# EAGLE design Chua (EAGLE 6.6.0)
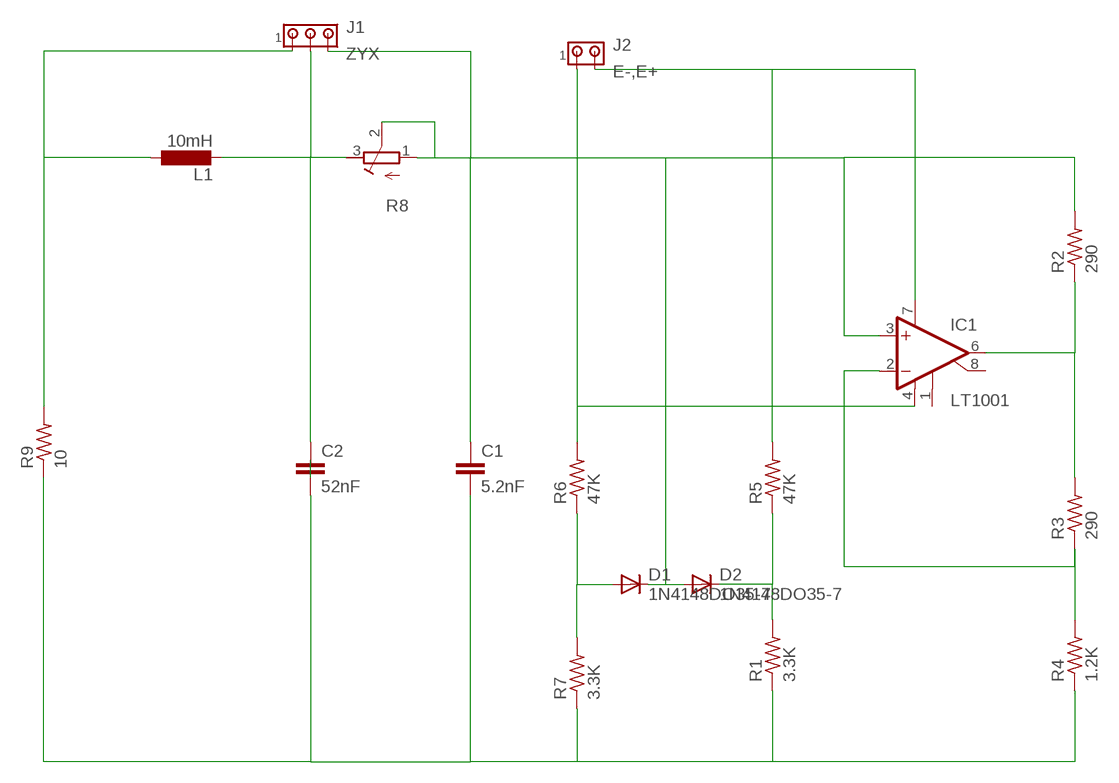
[diagram p0: schematic, sheet 1]

## Parts
C1  5.2nF  C-EU025-060X050  [C025-060X050]
C2  52nF  C-EU025-060X050  [C025-060X050]
D1  1N4148DO35-7  [DO35-7]
D2  1N4148DO35-7  [DO35-7]
IC1  LT1001  LT1001N  [DIL08]
J1  ZYX  MTA03-100  [10X03MTA]
J2  E-,E+  MTA02-100  [10X02MTA]
L1  10mH  L-EU0207/5V  [0207/5V]
R1  3.3K  R-US_0204/7  [0204/7]
R2  290  R-US_0204/7  [0204/7]
R3  290  R-US_0204/7  [0204/7]
R4  1.2K  R-US_0204/7  [0204/7]
R5  47K  R-US_0204/7  [0204/7]
R6  47K  R-US_0204/7  [0204/7]
R7  3.3K  R-US_0204/7  [0204/7]
R8  R-TRIMM3296Y  [RTRIM3296Y]
R9  10  R-US_0204/7  [0204/7]

## Nets
N$1: IC1.6(OUT) R2.1 R3.2
N$2: C1.2 C2.2 R1.1 R4.1 R7.1 R9.1
N$3: IC1.2(-IN) R3.1 R4.2
N$4: D2.C R1.2 R5.1
N$5: D1.A R6.1 R7.2
N$6: C1.1 D1.C D2.A IC1.3(+IN) J1.3 R2.2 R8.1(E) R8.2(S)
N$7: C2.1 J1.2 L1.2 R8.3(A)
N$8: J1.1 L1.1 R9.2
N$11: IC1.4(V-) J2.1 R6.2
N$12: IC1.7(V+) J2.2 R5.2
Unconnected: IC1.1(CMP1) IC1.8(CMP2)

## Library data of the parts
C1 C2 = resistor:C-EU: CAPACITOR, European symbol
D1 D2 = diode:1N4148: DIODE high speed (Philips)
IC1 = linear:LT1001: OP AMP
J1 = con-amp:MTA03-100: AMP connector
J2 = con-amp:MTA02-100: AMP connector
L1 = resistor:L-EU: INDUCTOR, European symbol
R1-R7 R9 = resistor:R-US_: RESISTOR, American symbol
R8 = resistor:R-TRIMM: Trimm resistor

## Board
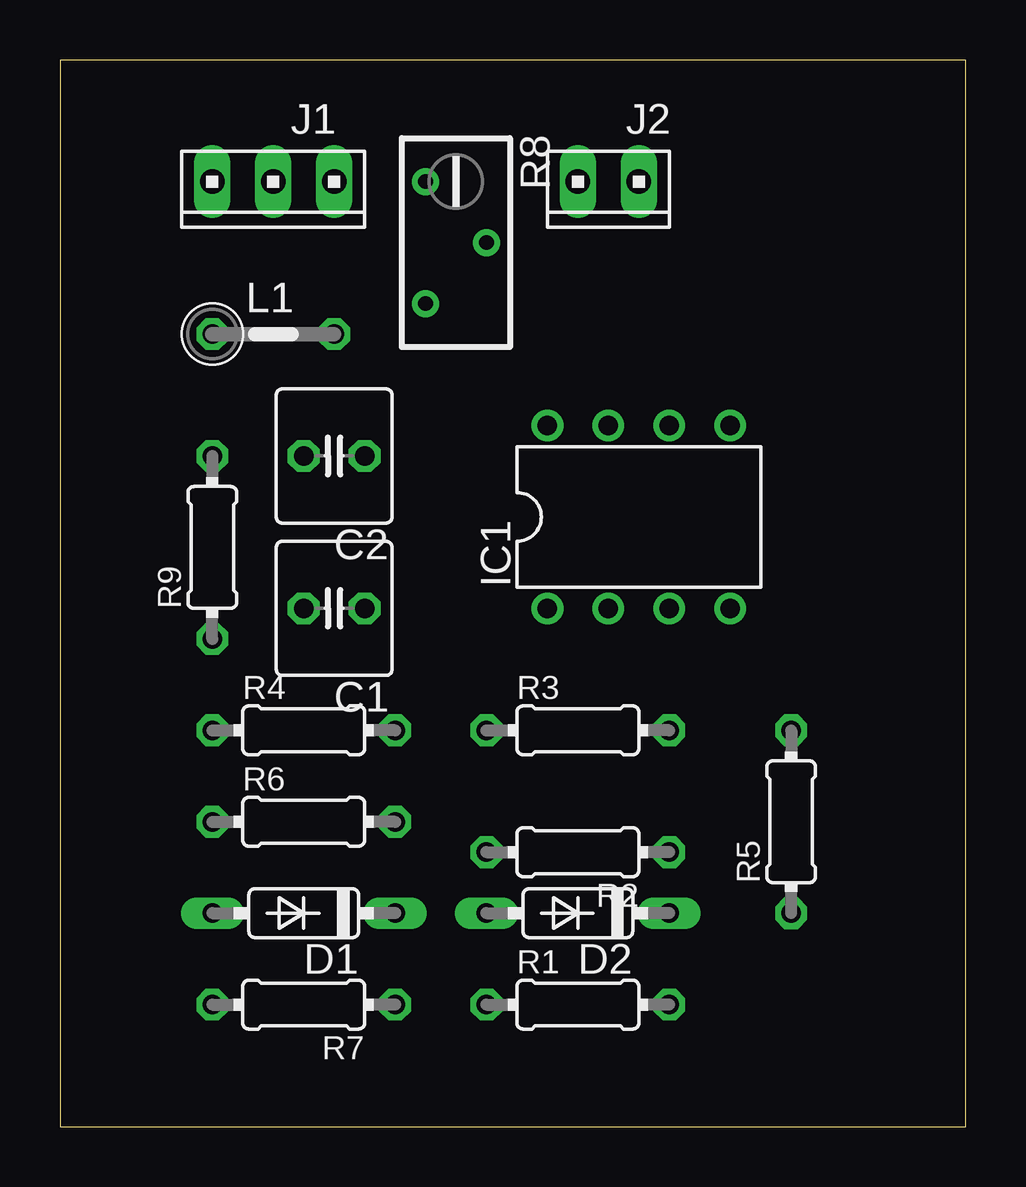
[diagram p1: board, top side]
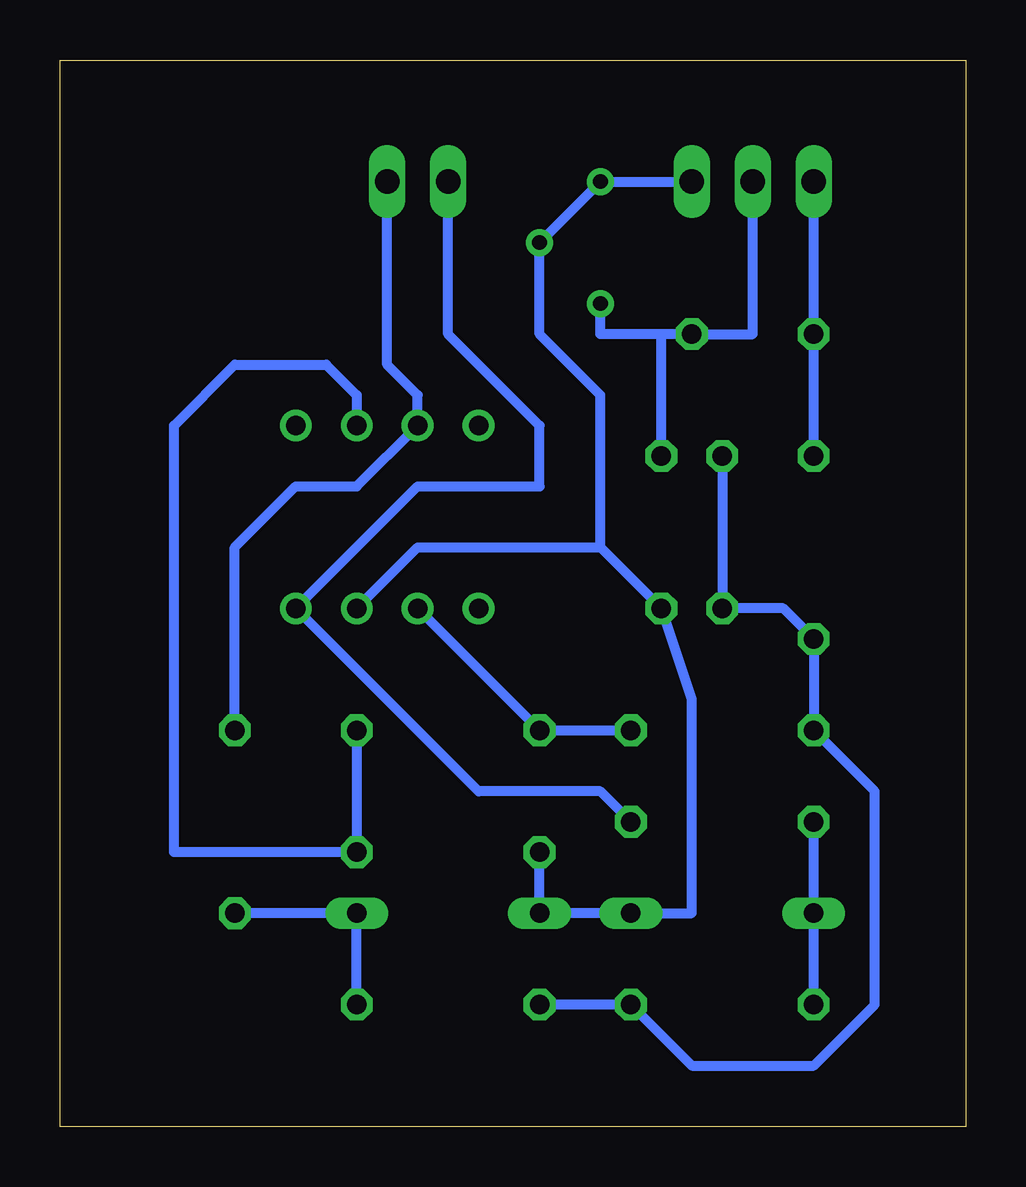
[diagram p2: board, bottom side, seen from below]

Size 37.77 x 44.44 mm. Coordinates in mm from the lower left corner, seen from the top.
Outline: 0,0 37.77,0 37.77,44.44 0,44.44 0,0
Copper layers (1*16): Top 0.035mm / dielectric 1.5mm / Bottom 0.035mm
Design rules "default": minimum track width 10mil, minimum drill 24mil, track to track 8mil, track to pad 8mil, pad to pad 8mil, via to via 8mil, smd to smd 8mil, copper to edge 40mil, drill to drill 8mil, minimum pad ring 10mil, minimum via ring 8mil, stop-mask expansion 4mil, vias tented up to drill 0mil, thermal gap 10mil

### Footprints (pad centres in the part's own frame; a part is rotated, then mirrored left to right if it is on the bottom)
C025-060X050 = drill 0.813 octagon: 1 -1.27,0; 2 1.27,0
DO35-7 = drill 0.813 long: A 3.81,0; C -3.81,0
DIL08 = drill 0.813 pad 1.27: 1 -3.81,-3.81; 2 -1.27,-3.81; 3 1.27,-3.81; 4 3.81,-3.81; 5 3.81,3.81; 6 1.27,3.81; 7 -1.27,3.81; 8 -3.81,3.81
10X03MTA = drill 1.016 long: 1 2.54,0; 2 0,0; 3 -2.54,0
10X02MTA = drill 1.016 long: 1 1.27,0; 2 -1.27,0
0207/5V = drill 0.813 octagon: 1 -2.54,0; 2 2.54,0
0204/7 = drill 0.813 octagon: 1 -3.81,0; 2 3.81,0
RTRIM3296Y = drill 0.61: 1 1.27,-2.54; 2 -1.27,0; 3 1.27,2.54

### Placement (x,y rotation side)
C1  11.43,21.59 180 top
C2  11.43,27.94 180 top
D1  10.16,8.89 180 top
D2  21.59,8.89 180 top
IC1  24.13,25.4 0 top
J1  8.89,39.37 180 top
J2  22.86,39.37 180 top
L1  8.89,33.02 0 top
R1  21.59,5.08 0 top
R2  21.59,11.43 180 top
R3  21.59,16.51 0 top
R4  10.16,16.51 0 top
R5  30.48,12.7 90 top
R6  10.16,12.7 0 top
R7  10.16,5.08 180 top
R8  16.51,36.83 180 top
R9  6.35,24.13 90 top

### Tracks (layer width: path | path; a pad name or v marks a point on that pad's centre or on a via)
N$1
  Bottom 0.406: R3.2 R2.1 33.02,11.43 33.02,29.21 30.48,31.75 26.67,31.75 25.4,30.48 IC1.6
N$2
  Bottom 0.406: C2.2 C1.2 7.62,21.59 R9.1 R4.1 3.81,13.97 3.81,5.08 6.35,2.54 11.43,2.54 R7.1 R1.1
N$3
  Bottom 0.406: R4.2 R3.1 IC1.2
N$4
  Bottom 0.406: R1.2 D2.C R5.1
N$5
  Bottom 0.406: R7.2 D1.A R6.1
N$6
  Bottom 0.406: R2.2 D2.A D1.C 11.43,8.89 11.43,17.78 C1.1 15.24,24.13 | IC1.3 22.86,24.13 15.24,24.13 | 15.24,24.13 15.24,30.48 17.78,33.02 R8.2 R8.1 J1.3
N$7
  Bottom 0.406: J1.2 8.89,33.02 L1.2 12.7,33.02 | C2.1 12.7,33.02 | 12.7,33.02 15.24,33.02 R8.3
N$8
  Bottom 0.406: R9.2 L1.1 J1.1
N$11
  Bottom 0.406: J2.1 21.59,33.02 17.78,29.21 17.78,26.67 22.86,26.67 IC1.4 20.32,13.97 15.24,13.97 R6.2
N$12
  Bottom 0.406: R5.2 30.48,24.13 27.94,26.67 25.4,26.67 IC1.7 22.86,30.48 24.13,31.75 J2.2